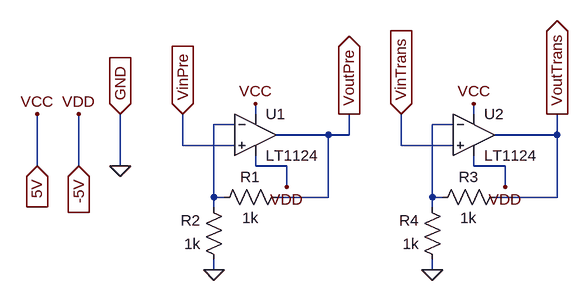
[diagram p0: schematic TransmissionPreAmp.asc]
TransmissionPreAmp.asc, the LTspice schematic file:
Version 4
SHEET 1 880 680
WIRE 144 144 144 128
WIRE 480 144 480 128
WIRE 112 160 80 160
WIRE 448 160 416 160
WIRE 256 176 176 176
WIRE 288 176 288 144
WIRE 288 176 256 176
WIRE 608 176 608 144
WIRE 608 176 512 176
WIRE 32 192 32 144
WIRE 112 192 32 192
WIRE 368 192 368 144
WIRE 448 192 368 192
WIRE -192 224 -192 144
WIRE -128 224 -128 144
WIRE -64 224 -64 144
WIRE 144 224 144 208
WIRE 192 224 144 224
WIRE 480 224 480 208
WIRE 528 224 480 224
WIRE 192 256 192 224
WIRE 528 256 528 224
WIRE 80 272 80 160
WIRE 96 272 80 272
WIRE 256 272 256 176
WIRE 256 272 176 272
WIRE 416 272 416 160
WIRE 432 272 416 272
WIRE 608 272 608 176
WIRE 608 272 512 272
WIRE 80 288 80 272
WIRE 416 288 416 272
WIRE 80 384 80 368
WIRE 416 384 416 368
FLAG 80 384 0
FLAG 416 384 0
FLAG 32 144 VinPre
IOPIN 32 144 In
FLAG 368 144 VinTrans
IOPIN 368 144 In
FLAG 192 256 VDD
FLAG 528 256 VDD
FLAG 144 128 VCC
FLAG 480 128 VCC
FLAG 288 144 VoutPre
IOPIN 288 144 Out
FLAG 608 144 VoutTrans
IOPIN 608 144 Out
FLAG -192 144 VCC
FLAG -128 144 VDD
FLAG -64 224 0
FLAG -192 224 5V
IOPIN -192 224 In
FLAG -128 224 -5V
IOPIN -128 224 In
FLAG -64 144 GND
IOPIN -64 144 In
SYMBOL Opamps\\LT1124 144 112 R0
SYMATTR InstName U1
SYMBOL Opamps\\LT1124 480 112 R0
SYMATTR InstName U2
SYMBOL res 192 256 R90
WINDOW 0 0 56 VBottom 2
WINDOW 3 32 56 VTop 2
SYMATTR InstName R1
SYMATTR Value 1k
SYMBOL res 96 384 R180
WINDOW 0 36 76 Left 2
WINDOW 3 36 40 Left 2
SYMATTR InstName R2
SYMATTR Value 1k
SYMBOL res 528 256 R90
WINDOW 0 0 56 VBottom 2
WINDOW 3 32 56 VTop 2
SYMATTR InstName R3
SYMATTR Value 1k
SYMBOL res 432 384 R180
WINDOW 0 36 76 Left 2
WINDOW 3 36 40 Left 2
SYMATTR InstName R4
SYMATTR Value 1k

The netlist it stands for:
* TransmissionPreAmp.asc
XU1 VinPre N001 5V -5V VoutPre LT1124  ; pins In+ In- V+ V- OUT
XU2 VinTrans N002 5V -5V VoutTrans LT1124  ; pins In+ In- V+ V- OUT
R1 VoutPre N001 1k
R2 0 N001 1k
R3 VoutTrans N002 1k
R4 0 N002 1k
.lib LTC.lib
.backanno
.end